# Altium schematic sheet shifting_buttons.SchDoc
size A4
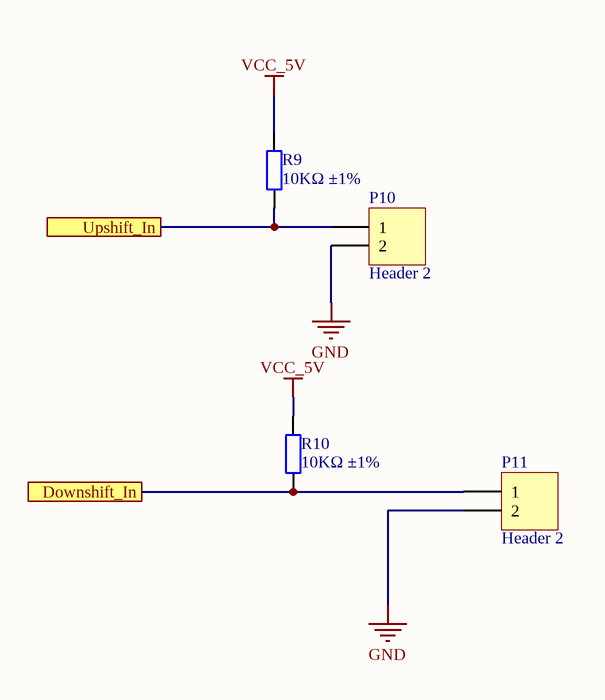
[diagram p0: shifting_buttons.SchDoc]

## Parts
P10  Header 2  [HDR1X2]
P11  Header 2  [HDR1X2]
R9  10KΩ ±1%  [0603_R]
R10  10KΩ ±1%  [0603_R]

## Ports
Downshift_In, Upshift_In

## Nets
GND: P10.2 P11.2
VCC_5V: R9.2 R10.2
Downshift_In: P11.1 R10.1 ; port Downshift_In
Upshift_In: P10.1 R9.1 ; port Upshift_In

## Library data of the parts
P10 P11 = Header 2: Header, 2-Pin; LatestRevisionDate: 17-Jul-2002; LatestRevisionNote: Re-released for DXP Platform.; Publisher: Altium Limited
R9 R10 = 0603 10K (1002) 1%: Chip resistor; Manufacturer: Uniroyal Elec; PartNumber: 0603WAF1002T5E; Power: 1/10W; ComponentLink1Description: Supplier link; ComponentLink1URL: http://www.szlcsc.com/product/details_26547.html; Package: 0603; Supplier: LC; SuppliersPartNumber: C25804; Resistance: 10KΩ; Tolerance: 1%